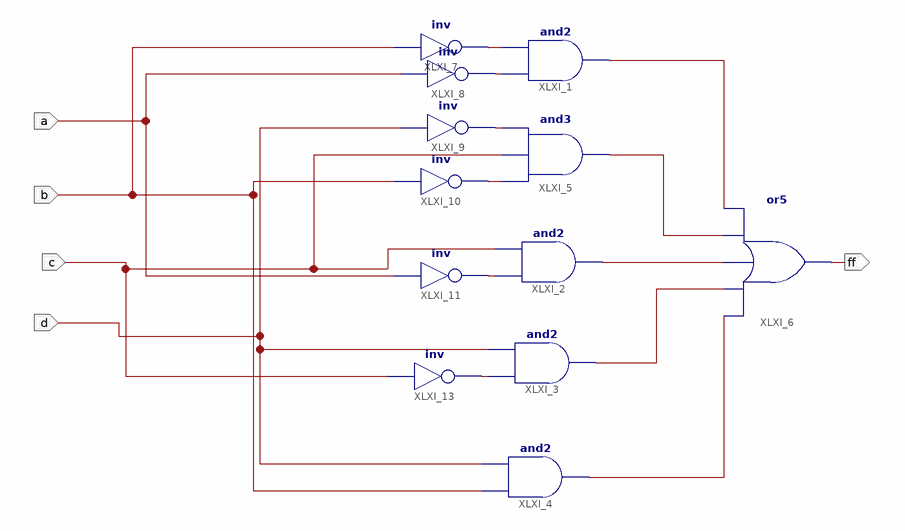
[diagram p0: schematic sheet 1]
// Xilinx ISE schematic hexF.sch (spartan6) as structural Verilog: 12 symbols, 5 ports
module hexF (
  input  a,
  input  b,
  input  c,
  input  d,
  output ff
);

  wire XLXN_1, XLXN_2, XLXN_3, XLXN_4, XLXN_5, XLXN_7, XLXN_8, XLXN_9, XLXN_10, XLXN_11, XLXN_12;

  and XLXI_1 (XLXN_1, XLXN_8, XLXN_7);
  and XLXI_2 (XLXN_3, XLXN_11, c);
  and XLXI_3 (XLXN_4, XLXN_12, d);
  and XLXI_4 (XLXN_5, b, d);
  and XLXI_5 (XLXN_2, XLXN_10, c, XLXN_9);
  or XLXI_6 (ff, XLXN_5, XLXN_4, XLXN_3, XLXN_2, XLXN_1);
  not XLXI_7 (XLXN_7, b);
  not XLXI_8 (XLXN_8, a);
  not XLXI_9 (XLXN_9, d);
  not XLXI_10 (XLXN_10, b);
  not XLXI_11 (XLXN_11, a);
  not XLXI_13 (XLXN_12, c);
endmodule
